# EAGLE design CANine (EAGLE 9.6.2)
Therm
CNAME: CANable USB<=>CAN; CREVISION: 0.1; DESIGNER: Ethan Zonca
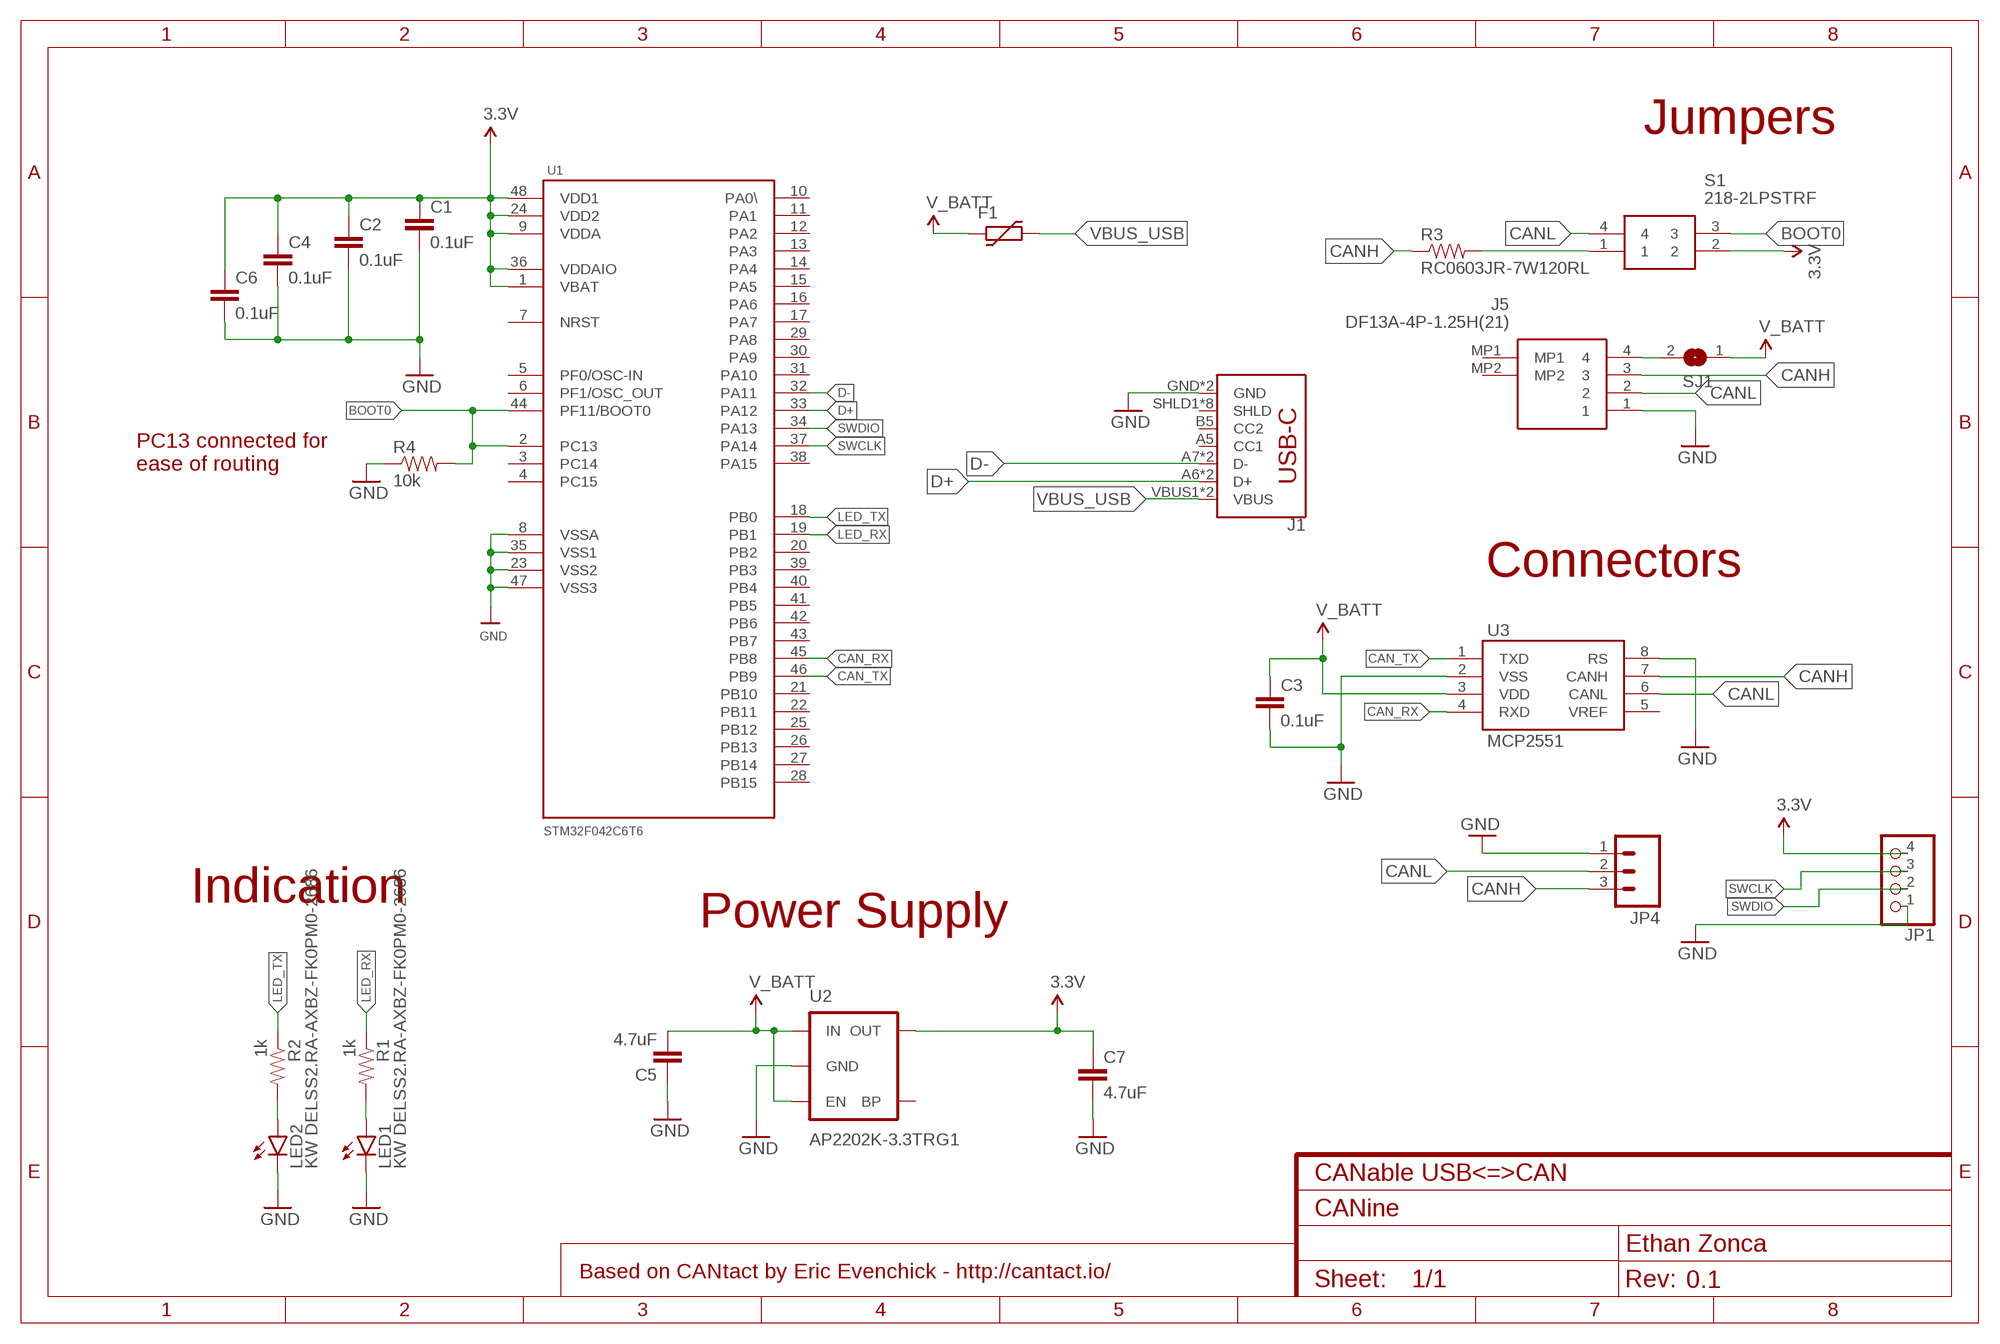
[diagram p0: schematic, sheet 1]

## Parts
C1  0.1uF  CAP0603-CAP  [0603-CAP]
C2  0.1uF  CAP0603-CAP  [0603-CAP]
C3  0.1uF  CAP0603-CAP  [0603-CAP]
C4  0.1uF  CAP0603-CAP  [0603-CAP]
C5  4.7uF  CAP0603-CAP  [0603-CAP]
C6  0.1uF  CAP0603-CAP  [0603-CAP]
C7  4.7uF  CAP0603-CAP  [0603-CAP]
F1  FUSE_PTC-0805  [PTC0805]
J1  SPARKFUN-CONNECTORS_USB_C16PIN  [SPARKFUN-CONNECTORS_USB-C-16P]
J5  DF13A-4P-1.25H(21)  [DF13A4P125H21]
JP1  PINHD-1X04_2.54-S  [1X04-S]
JP4  M03LOCK  [1X03_LOCK]
LED1  KW DELSS2.RA-AXBZ-FK0PM0-2686  LED0603  [LED-0603]
LED2  KW DELSS2.RA-AXBZ-FK0PM0-2686  LED0603  [LED-0603]
R1  1k  RESISTOR0603-RES  [0603-RES]
R2  1k  RESISTOR0603-RES  [0603-RES]
R3  RC0603JR-7W120RL  RESISTOR0603-RES  [0603-RES]
R4  10k  RESISTOR0603-RES  [0603-RES]
S1  218-2LPSTRF  [2182LPSTRF]
SJ1  SJ  [SJ]
U1  STM32F042C6T6  [LQFP48]
U2  AP2202K-3.3TRG1  MIC52053.3V  [SOT23-5]
U3  MCP2551  [SO08]

## Nets
3.3V: C1.1 C2.1 C4.1 C6.1 C7.1 JP1.4 S1.2 U1.1(VBAT) U1.9(VDDA) U1.24(VDD2) U1.36(VDDAIO) U1.48(VDD1) U2.5(OUT)
BOOT0: R4.2 S1.3 U1.2(PC13) U1.44(PF11/BOOT0)
CAN_RX: U1.45(PB8) U3.4(RXD)
CAN_TX: U1.46(PB9) U3.1(TXD)
CANH: J5.3 JP4.3 R3.1 U3.7(CANH)
CANL: J5.2 JP4.2 S1.4 U3.6(CANL)
D+: J1.A6(D+) J1.B6(D+) U1.33(PA12)
D-: J1.A7(D-) J1.B7(D-) U1.32(PA11)
GND: C1.2 C2.2 C3.2 C4.2 C5.1 C6.2 C7.2 J1.GND J1.GND2(GND) J5.1 JP1.1 JP4.1 LED1.C LED2.C R4.1 U1.8(VSSA) U1.23(VSS2) U1.35(VSS1) U1.47(VSS3) U2.2(GND) U3.2(VSS) U3.8(RS)
LED_RX: R1.1 U1.19(PB1)
LED_TX: R2.1 U1.18(PB0)
N$2: LED2.A R2.2
N$3: R3.2 S1.1
N$4: J5.4 SJ1.2
N$23: LED1.A R1.2
SWCLK: JP1.3 U1.37(PA14)
SWDIO: JP1.2 U1.34(PA13)
V_BATT: C3.1 C5.2 F1.1 SJ1.1 U2.1(IN) U2.3(EN) U3.3(VDD)
VBUS_USB: F1.2 J1.VBUS1(VBUS) J1.VBUS2(VBUS)
Unconnected: J1.A5(CC1) J1.B5(CC2) J1.SHLD1(SHLD) J1.SHLD2(SHLD) J1.SHLD3(SHLD) J1.SHLD4(SHLD) J1.SHLD5(SHLD) J1.SHLD6(SHLD) J1.SHLD7(SHLD) J1.SHLD8(SHLD) J5.MP1 J5.MP2 U1.3(PC14) U1.4(PC15) U1.5(PF0/OSC-IN) U1.6(PF1/OSC_OUT) U1.7(NRST) U1.10(PA0\) U1.11(PA1) U1.12(PA2) U1.13(PA3) U1.14(PA4) U1.15(PA5) U1.16(PA6) U1.17(PA7) U1.20(PB2) U1.21(PB10) U1.22(PB11) U1.25(PB12) U1.26(PB13) U1.27(PB14) U1.28(PB15) U1.29(PA8) U1.30(PA9) U1.31(PA10) U1.38(PA15) U1.39(PB3) U1.40(PB4) U1.41(PB5) U1.42(PB6) U1.43(PB7) U2.4(BP) U3.5(VREF)

## Notes on the sheet
- Jumpers
- PC13 connected for
  ease of routing
- Connectors
- Indication
- Power Supply
- Based on CANtact by Eric Evenchick - http://cantact.io/

## Library data of the parts
C1-C7 = SparkFun-Passives:CAP: Capacitor Standard 0603 ceramic capacitor, and 0.1" leaded capacitor.
F1 = dp_devices:FUSE_PTC: Resettable PTC
J1 = USB-C-Breakout:SPARKFUN-CONNECTORS_USB_C: USB Type C 16Pin Connector Super Speed pins not available on the 16-pin purely SMD connector so this part is best for USB 2.0 implementations. D1 and D2 are tied together enabling D+/- no matter which way the cable is plugged into the connector. The two channel configuration pins (CC1/2) are exposed. These are normally connected to ground via 5.1k resistors but can be reconfigured for high current/high power applications.; PROD_ID: CONN-14122
J5 = SamacSys_Parts:DF13A-4P-1.25H(21): Headers & Wire Housings 4P SNG ROW PIN HDR R/A SMT Source: Datasheet <https://componentsearchengine.com/Datasheets/1/DF13A-4P-1.25H(21).pdf>; DESCRIPTION: Headers & Wire Housings 4P SNG ROW PIN HDR R/A SMT; HEIGHT: 3.6mm; MANUFACTURER_NAME: Hirose; MANUFACTURER_PART_NUMBER: DF13A-4P-1.25H(21); MOUSER_PART_NUMBER: 798-DF13A4P125H21; MOUSER_PRICE-STOCK: https://www.mouser.com/Search/Refine.aspx?Keyword=798-DF13A4P125H21; RS_PART_NUMBER: 1886349; RS_PRICE-STOCK: http://uk.rs-online.com/web/p/products/1886349
JP1 = pinhead-2:PINHD-1X04: PIN HEADER
JP4 = SparkFun-Connectors:M03: Header 3 Standard 3-pin 0.1" header. Use with straight break away headers (SKU : PRT-00116), right angle break away headers (PRT-00553), swiss pins (PRT-00743), machine pins (PRT-00117), and female headers (PRT-00115). Molex polarized connector foot print use with SKU : PRT-08232 with associated crimp pins and housings.
LED1 LED2 = SparkFun-LED:LED: LEDs Standard schematic elements and footprints for 5mm, 3mm, 1206, and 0603 sized LEDs. 5mm - Spark Fun Electronics SKU : COM-00529 (and others)
R1-R4 = SparkFun-Passives:RESISTOR: Resistor Basic schematic elements and footprints for 0603, 1206, and PTH resistors.
S1 = SamacSys_Parts:218-2LPSTRF: SWITCH SLIDE DIP SPST 25MA 24V Source: Datasheet <https://www.ctscorp.com/wp-content/uploads/218.pdf>; DESCRIPTION: SWITCH SLIDE DIP SPST 25MA 24V; HEIGHT: 2.65mm; MANUFACTURER_NAME: CTS; MANUFACTURER_PART_NUMBER: 218-2LPSTRF; MOUSER_PART_NUMBER: 774-218-2LPSTRF; MOUSER_PRICE-STOCK: https://www.mouser.co.uk/ProductDetail/CTS-Electronic-Components/218-2LPSTRF?qs=6E8igxPflKfid29mp1Rq8Q%3D%3D
SJ1 = jumper:SJ: SMD solder JUMPER
U1 = Protofusion:STM32F042C6T6
U2 = SparkFun-PowerIC:MIC5205: MIC5205 150mA vreg 3.3V - VREG-00822 5V - VREG-00823; PROD_ID: VREG-00822
U3 = SparkFun-DigitalIC:MCP2551: CAN transceiver; PROD_ID: IC-09907

## Board
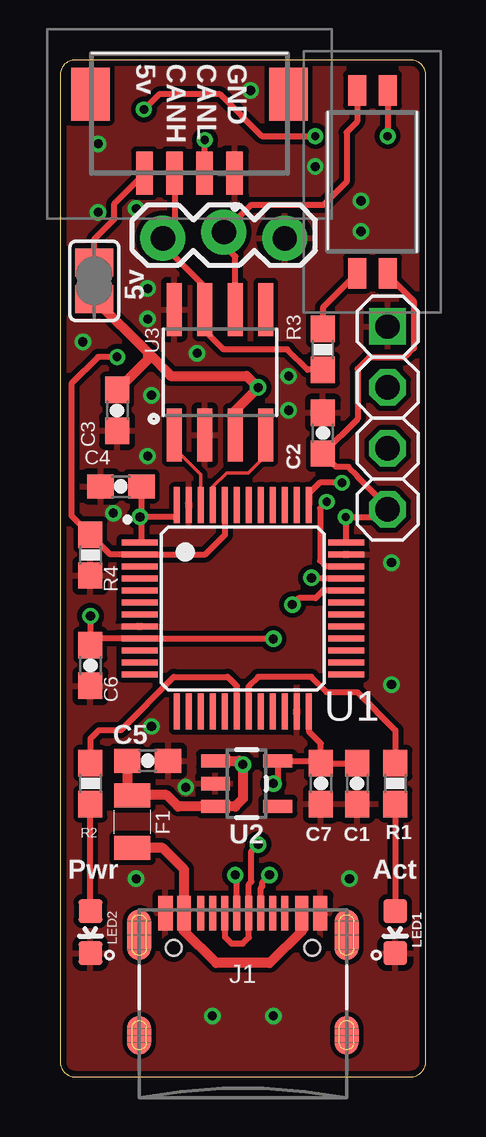
[diagram p1: board, top side]
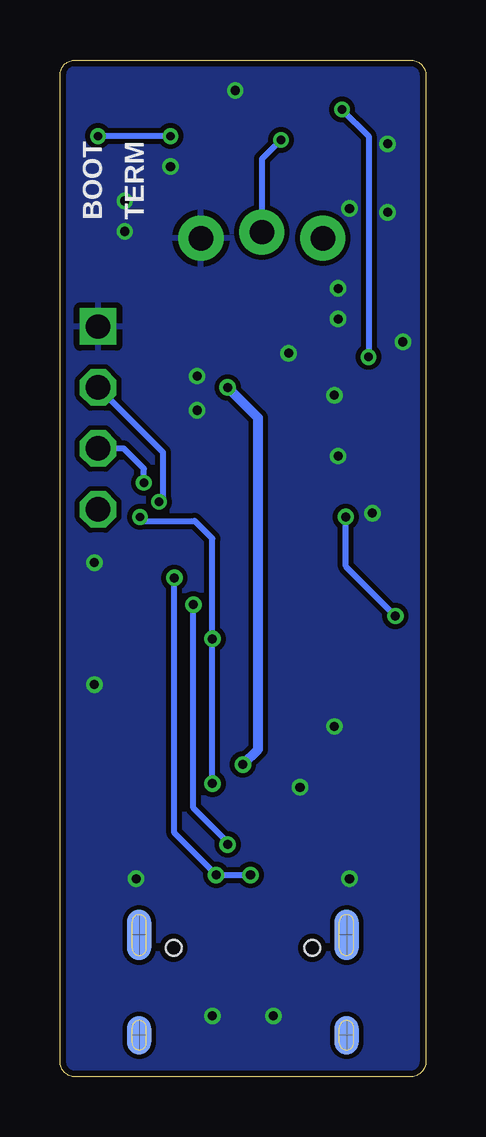
[diagram p2: board, bottom side, seen from below]

Size 15.24 x 42.39 mm. Coordinates in mm from the lower left corner, seen from the top.
Outline: 0,41.75 0,0.64 arc90 0.64,0 14.61,0 arc90 15.24,0.64 15.24,41.75 arc90 14.61,42.39 0.64,42.39 arc90 0,41.75
Copper layers (1*16): Top 0.035mm / dielectric 1.5mm / Bottom 0.035mm
Design rules "Elecrow_2-layer_eagle_rule *": minimum track width 6mil, minimum drill 12mil, track to track 8mil, track to pad 8mil, pad to pad 8mil, via to via 8mil, smd to smd 0mil, copper to edge 10mil, drill to drill 10mil, minimum pad ring 10mil, minimum via ring 6mil, stop-mask expansion 2mil, vias tented up to drill 100mil, thermal gap 10mil

### Footprints (pad centres in the part's own frame; a part is rotated, then mirrored left to right if it is on the bottom)
0603-CAP = smd 1.1 x 1: 1 -0.85,0; 2 0.85,0
PTC0805 = smd 1 x 1.5: 1 -1.1,0; 2 1.1,0
SPARKFUN-CONNECTORS_USB-C-16P = smd 0.3 x 1.45: A5 -1.25,0; A6 -0.25,0; A7 0.25,0; A8 1.25,0; B5 1.75,0; B6 0.75,0; B7 -0.75,0; B8 -1.75,0 | smd 0.6 x 1.45: GND -3.225,0; GND2 3.225,0 | smd 1 x 2.1: SHLD1 -4.32,-0.915; SHLD2 4.32,-0.915 | smd 1 x 2.1 bottom: SHLD3 -4.32,-0.915; SHLD4 4.32,-0.915 | smd 1 x 1.6: SHLD5 -4.32,-5.095; SHLD8 4.32,-5.095 | smd 1 x 1.6 bottom: SHLD6 -4.32,-5.095; SHLD7 4.32,-5.095 | smd 0.55 x 1.45: VBUS1 -2.45,0; VBUS2 2.45,0 | hole 0.65: -2.89,-1.445; 2.89,-1.445
DF13A4P125H21 = smd 0.7 x 1.8: 1 1.875,-2.5; 2 0.625,-2.5; 3 -0.625,-2.5; 4 -1.875,-2.5 | smd 1.6 x 2.2: MP1 -4.125,0.8; MP2 4.125,0.8
1X04-S = drill 1.016 square: 1 -3.81,0 | drill 1.016 octagon: 2 -1.27,0; 3 1.27,0; 4 3.81,0
1X03_LOCK = drill 1.016 pad 1.88: 1 0,0.127; 2 2.54,-0.127; 3 5.08,0.127
LED-0603 = smd 1 x 1: A 0,-0.877; C 0,0.877
0603-RES = smd 1.1 x 1: 1 -0.85,0; 2 0.85,0
2182LPSTRF = smd 0.76 x 1.27: 1 -0.635,-3.81; 2 0.635,-3.81; 3 0.635,3.81; 4 -0.635,3.81
SJ = smd 1.168 x 1.6: 1 -0.762,0; 2 0.762,0
LQFP48 = smd 1.5 x 0.25: 1 -4.3,2.75; 2 -4.3,2.25; 3 -4.3,1.75; 4 -4.3,1.25; 5 -4.3,0.75; 6 -4.3,0.25; 7 -4.3,-0.25; 8 -4.3,-0.75; 9 -4.3,-1.25; 10 -4.3,-1.75; 11 -4.3,-2.25; 12 -4.3,-2.75; 25 4.3,-2.75; 26 4.3,-2.25; 27 4.3,-1.75; 28 4.3,-1.25; 29 4.3,-0.75; 30 4.3,-0.25; 31 4.3,0.25; 32 4.3,0.75; 33 4.3,1.25; 34 4.3,1.75; 35 4.3,2.25; 36 4.3,2.75 | smd 0.25 x 1.5: 13 -2.75,-4.3; 14 -2.25,-4.3; 15 -1.75,-4.3; 16 -1.25,-4.3; 17 -0.75,-4.3; 18 -0.25,-4.3; 19 0.25,-4.3; 20 0.75,-4.3; 21 1.25,-4.3; 22 1.75,-4.3; 23 2.25,-4.3; 24 2.75,-4.3; 37 2.75,4.3; 38 2.25,4.3; 39 1.75,4.3; 40 1.25,4.3; 41 0.75,4.3; 42 0.25,4.3; 43 -0.25,4.3; 44 -0.75,4.3; 45 -1.25,4.3; 46 -1.75,4.3; 47 -2.25,4.3; 48 -2.75,4.3
SOT23-5 = smd 0.55 x 1.2: 1 -0.95,-1.3; 2 0,-1.3; 3 0.95,-1.3; 4 0.95,1.3; 5 -0.95,1.3
SO08 = smd 0.61 x 2.21: 1 -1.905,-2.616; 2 -0.635,-2.616; 3 0.635,-2.616; 4 1.905,-2.616; 5 1.905,2.616; 6 0.635,2.616; 7 -0.635,2.616; 8 -1.905,2.616

### Placement (x,y rotation side)
C1  12.38,12.22 270 top
C2  10.95,26.83 90 top
C3  2.38,27.78 270 top
C4  2.54,24.61 180 top
C5  3.65,13.18 180 top
C6  1.27,17.14 270 top
C7  10.87,12.22 270 top
F1  3.02,10.64 270 top
J1  7.62,6.83 0 top
J5  5.4,40.16 0 top
JP1  13.65,27.46 270 top
JP4  9.37,35.08 180 top
LED1  13.97,6.03 180 top
LED2  1.27,6.03 180 top
R1  13.97,12.22 270 top
R2  1.27,12.22 270 top
R3  10.95,30.32 90 top
R4  1.27,21.75 90 top
S1  13.02,37.31 0 top
SJ1  1.43,33.18 90 top
U1  7.62,19.53 0 top
U2  7.78,12.22 270 top
U3  6.67,29.37 0 top

### Tracks (layer width: path | path; a pad name or v marks a point on that pad's centre or on a via)
3.3V  (via drill 0.35, 0.38)
  Top 0.254: v8.89,12.22 9.08,12.41 U2.5 10.77,13.17 C7.1 | v1.27,19.21 C6.1 1.55,18.28 U1.9 8.87,18.28 v8.89,18.26 | C4.1 3.39,23.34 | 3.39,23.34 3.39,22.35 U1.1 | U1.48 4.87,23.39 4.82,23.34 v3.33,23.34 3.39,23.34 | U1.24 10.37,14.4 10.87,13.89 C7.1 | C7.1 C1.1 | U1.36 11.92,23.32 v11.91,23.34 13.34,23.34 JP1.4 13.65,23.76 12.4,25 12.4,25.04 12.02,25.42 11.51,25.42 C2.1 12.4,27.43 12.4,29.5 12.88,29.98 14.35,29.98 14.75,30.38 14.75,32.33 13.65,33.42 S1.2
  Bottom 0.254: v1.27,19.21 3.33,21.27 v3.33,23.34 | v8.89,12.22 v8.89,18.26 8.89,22.44 9.63,23.18 11.75,23.18 v11.91,23.34
BOOT0  (via drill 0.35)
  Top 0.254: U1.44 6.87,22.59 6.06,21.78 U1.2 2.09,21.78 R4.2 0.48,23.39 0.48,28.89 1.59,30 v2.38,30 | v3.49,40.32 4.13,40.96 6.67,40.96 8.41,39.21 v10.64,39.21 | S1.3 v13.65,39.21
  Bottom 0.254: v3.49,40.32 2.38,39.21 v2.38,30 | v10.64,39.21 v13.65,39.21
CAN_RX
  Top 0.152: U3.4 8.57,25.9 7.85,25.17 6.95,25.17 6.37,24.6 U1.45
CAN_TX
  Top 0.152: U3.1 4.76,26.22 5.87,25.11 U1.46
CANH
  Top 0.254: R3.1 10.32,29.47 9.47,30.32 6.83,30.32 6.03,31.12 U3.7 6.03,32.94 4.29,34.68 JP4.3 4.77,35.44 J5.3
CANL  (via drill 0.35)
  Top 0.254: S1.4 12.38,39.81 11.94,39.37 11.94,37.31 10.98,36.35 7.97,36.35 JP4.2 6.83,34.67 7.3,34.19 U3.6 | J5.2 6.02,39.04 v6.03,39.05
  Bottom 0.254: v6.03,39.05 6.83,38.26 JP4.2
D+  (via drill 0.38)
  Top 0.254: U1.33 10.5,20.78 v10.48,20.8 | J1.A6 7.37,8.35 v7.3,8.41 | J1.B6 8.37,7.88 8.43,7.95 8.43,8.12 v8.73,8.41
  Bottom 0.254: v10.48,20.8 10.48,10.16 v8.73,8.41 v7.3,8.41
D-  (via drill 0.38)
  Top 0.254: U1.32 10.97,20.28 10.65,19.96 9.96,19.96 v9.68,19.69 | v8.26,9.68 7.98,9.4 7.98,8.14 7.87,8.03 J1.A7 7.87,5.81 7.62,5.56 7.14,5.56 6.87,5.83 J1.B7
  Bottom 0.254: v9.68,19.69 9.68,11.21 8.26,9.78 v8.26,9.68
GND  (via drill 0.38)
  other vias: 12.06,8.25 3.17,8.25 9.53,29.21 2.22,23.49 3.81,14.61 5.24,12.06 1.59,36.04 1.59,38.89 12.54,36.51 12.54,35.24 13.81,21.43 10.64,37.94 9.53,27.78 13.81,16.35 3.81,28.42 5.71,30.16 8.89,2.54 6.35,2.54 7.94,41.12 3.65,31.59 3.65,32.86 0.95,30.64 3.65,25.88 3.17,36.2
  pour Bottom: -1.91,46.83 19.68,46.83 19.68,-0.79 -1.91,-0.79
  pour Top: -3.17,-1.42 20.95,-0.94 20.95,47.47 -3.17,47.47
LED_RX
  Top 0.254: U1.19 7.87,16.28 8.26,16.67 10.48,16.67 11.11,16.03 12.38,16.03 13.97,14.45 R1.1
LED_TX
  Top 0.254: U1.18 7.37,16.28 6.99,16.67 4.75,16.67 2.53,14.45 1.62,14.45 1.27,14.09 R2.1
N$1
  cutout Top: 4.45,32.23 5.08,32.23 5.08,32.86 4.45,32.86
N$2
  Top 0.254: LED2.A R2.2
N$3
  Top 0.254: S1.1 10.95,32.07 R3.2
N$4
  Top 0.254: SJ1.2 1.43,34.93 2.26,35.76 2.26,36.4 J5.4
N$23
  Top 0.254: R1.2 LED1.A
SWCLK  (via drill 0.35)
  Top 0.254: v11.75,24.77 10.82,24.77 10.38,24.33 10.38,23.84 U1.37
  Bottom 0.254: v11.75,24.77 11.75,25.35 12.59,26.19 JP1.3
SWDIO  (via drill 0.35)
  Top 0.254: U1.34 11.08,21.28 10.84,21.51 10.84,23.7 v11.11,23.97
  Bottom 0.254: v11.11,23.97 10.95,24.13 10.95,26.04 JP1.2
V_BATT  (via drill 0.38)
  Top 0.254: U2.3
  Top 0.406: U3.3 7.3,27.78 v8.26,28.73 7.78,29.21 4.6,29.21 4.6,29.24 3.67,30.18 | C5.2 2.8,11.95 F1.1 3.03,11.75 4.45,11.75 4.92,11.27 U2.3 7.3,11.27 7.62,11.59 v7.62,13.02 7.46,13.17 U2.1 | SJ1.1 3.67,30.18 | C3.1 3.67,29.92 3.67,30.18
  Bottom 0.406: v8.26,28.73 6.99,27.46 6.99,13.65 v7.62,13.02
VBUS_USB
  Top 0.406: F1.2 4.28,9.54 5.17,8.64 J1.VBUS1 5.16,6.81 5.16,6.09 6.5,4.74 8.74,4.74 10.09,6.09 10.09,6.81 J1.VBUS2

### Text on the board
tPlace: 5v | CANH | CANL | GND | 5v | Pwr | Act
bPlace: TERM | BOOT